# EAGLE design electronic_load (EAGLE 6.5.0)
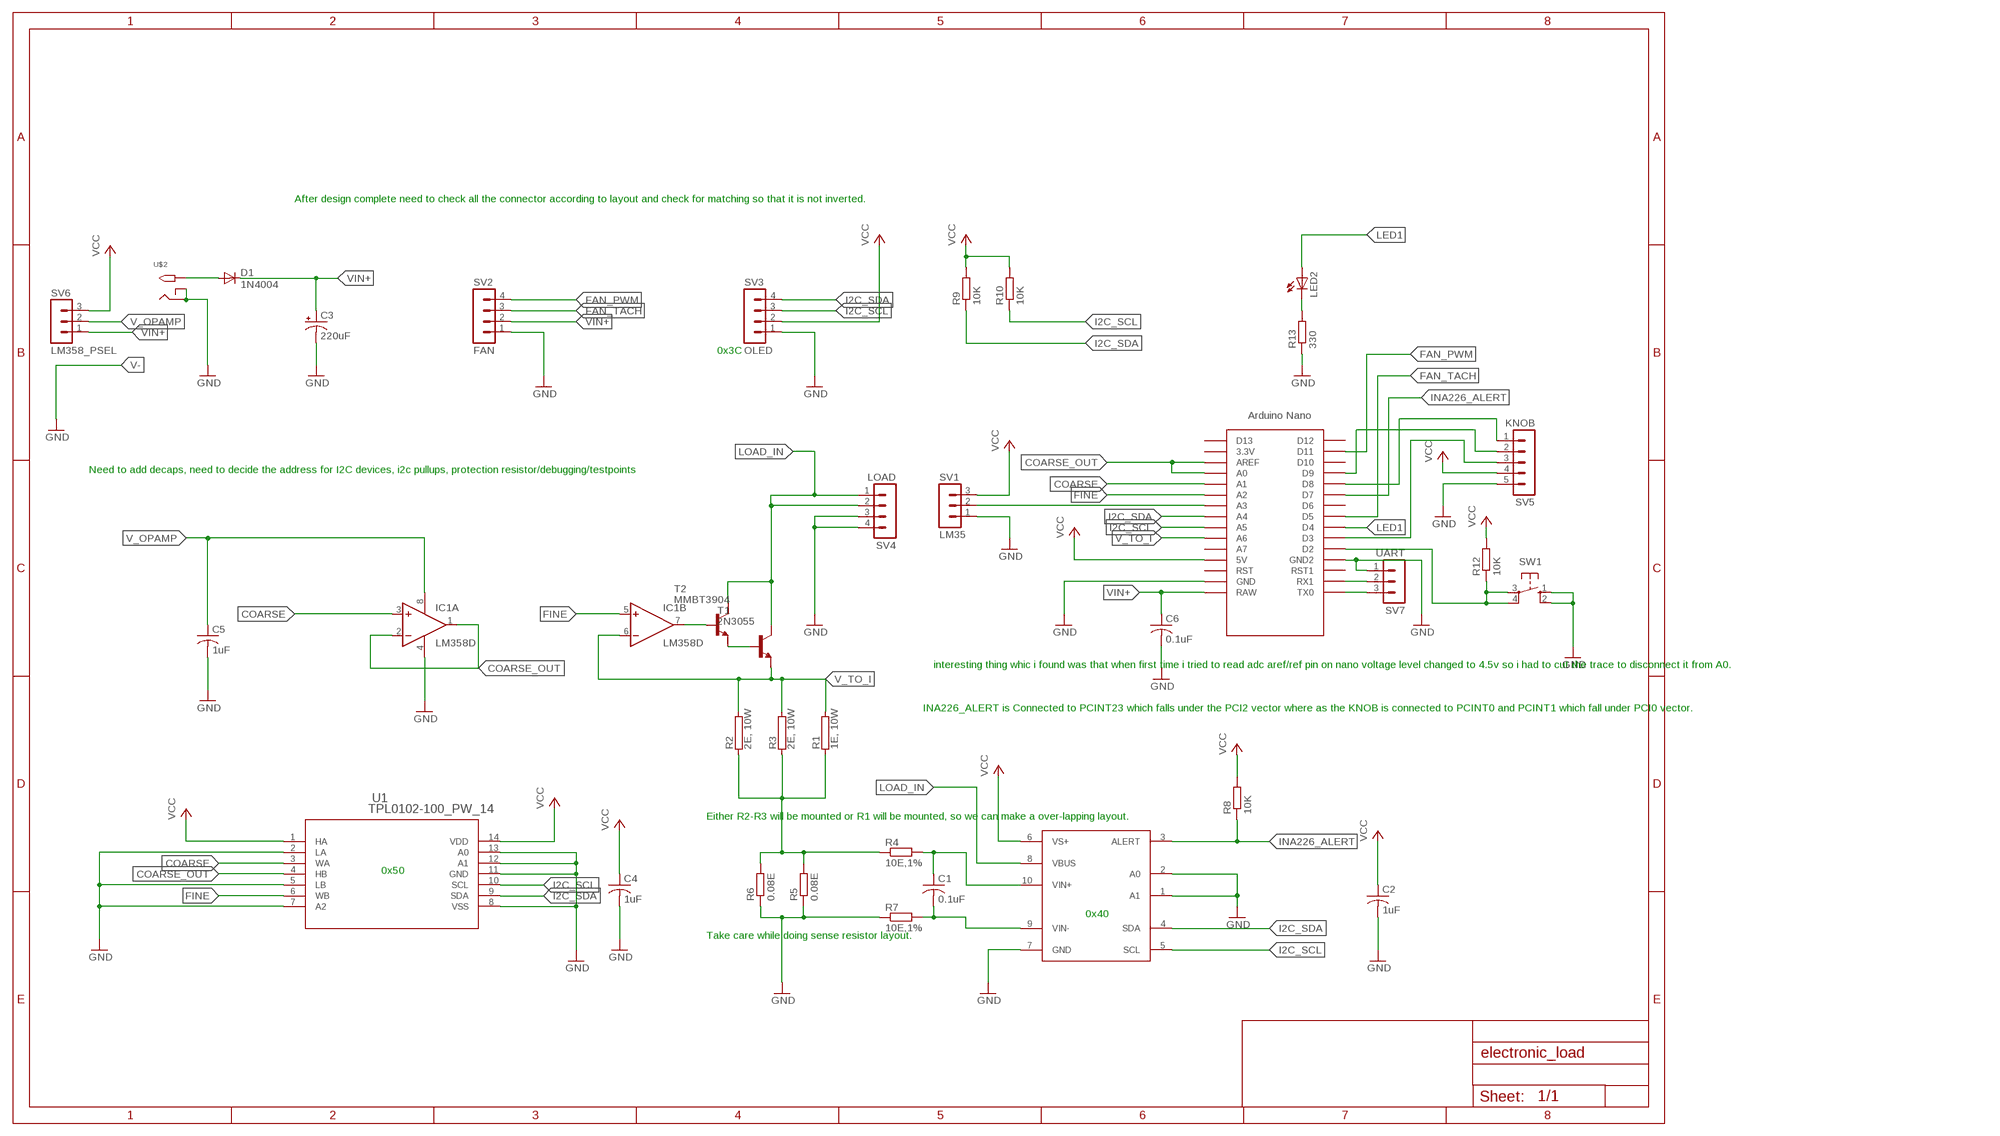
[diagram p0: schematic, sheet 1]

## Parts
C1  0.1uF  C-USC0805  [C0805]
C2  1uF  C-USC0805  [C0805]
C3  220uF  CPOL-USE3.5-8  [E3,5-8]
C4  1uF  C-USC0805  [C0805]
C5  1uF  C-USC1206  [C1206]
C6  0.1uF  C-USC1206  [C1206]
D1  1N4004  [DO41-10]
IC1  LM358D  [SO08]
LED2  LED3MM  [LED3MM]
R1  1E, 10W  RAC10  [AC10]
R2  2E, 10W  RCA4150  [CA4150]
R3  2E, 10W  RCA4150  [CA4150]
R4  10E,1%  R-EU_R0805  [R0805]
R5  0.08E  R-EU_R2512  [R2512]
R6  0.08E  R-EU_R2512  [R2512]
R7  10E,1%  R-EU_R0805  [R0805]
R8  10K  R-EU_R0805  [R0805]
R9  10K  R-EU_R0805  [R0805]
R10  10K  R-EU_R0805  [R0805]
R12  10K  R-EU_R0805  [R0805]
R13  330  R-EU_R0805  [R0805]
SV1  LM35  MA03-1  [MA03-1]
SV2  FAN  MA04-1  [MA04-1]
SV3  OLED  MA04-1  [MA04-1]
SV4  LOAD  MA04-1  [MA04-1]
SV5  KNOB  MA05-1  [MA05-1]
SV6  LM358_PSEL  MA03-1  [MA03-1]
SV7  UART  MA03-1  [MA03-1]
SW1  10-XX  [B3F-10XX]
T1  2N3055  [TO3]
T2  MMBT3904  MMBT3904LT1-NPN-SOT23-BEC  [SOT23-BEC]
U1  TPL0102-100_PW_14  [PW14]
U2  INA226AIDGST  [SOP50P490X110-10N]
U$1  NANO  [NANO]
U$2  2.1MMJACKTHM  [PJ-102A]

## Nets
COARSE: IC1.3(A:+IN) U1.3(WA) U$1.A1
COARSE_OUT: IC1.1(A:OUT) IC1.2(A:-IN) U1.4(HB) U$1.A0 U$1.AREF
FAN_PWM: SV2.4 U$1.D11
FAN_TACH: SV2.3 U$1.D5
FINE: IC1.5(B:+IN) U1.6(WB) U$1.A2
GND: C2.2 C3.- C4.2 C5.2 C6.2 IC1.4(P:V-) R5.1 R6.1 R7.1 R13.1 SV1.1 SV2.1 SV3.1 SV4.3 SV4.4 SV5.5 SV7.1 SW1.1(S) SW1.2(S1) U1.2(LA) U1.5(LB) U1.7(A2) U1.8(VSS) U1.11(GND) U1.12(A1) U1.13(A0) U2.1(A1) U2.2(A0) U2.7(GND) U$1.GND U$1.GND1(GND2) U$2.RING U$2.RING_SW
I2C_SCL: R10.1 SV3.3 U1.10(SCL) U2.5(SCL) U$1.A5
I2C_SDA: R9.1 SV3.4 U1.9(SDA) U2.4(SDA) U$1.A4
INA226_ALERT: R8.1 U2.3(ALERT) U$1.D7
LED1: LED2.A U$1.D4
LOAD_IN: SV4.1 SV4.2 T1.C T1.C/(C) T2.C U2.8(VBUS)
N$1: SV7.2 U$1.RX1
N$2: D1.A U$2.TIP
N$3: T1.B T2.E
N$4: R1.1 R2.1 R3.1 R4.1 R5.2 R6.2
N$5: C1.1 R4.2 U2.10(VIN+)
N$6: SV1.2 U$1.A3
N$7: C1.2 R7.2 U2.9(VIN-)
N$8: IC1.7(B:OUT) T2.B
N$9: SV5.3 U$1.D3
N$11: R12.1 SW1.3(P) SW1.4(P1) U$1.D2
N$13: LED2.K(C) R13.2
N$14: SV7.3 U$1.TX0
N$15: SV5.2 U$1.D9
N$16: SV5.1 U$1.D8
V_OPAMP: C5.1 IC1.8(P:V+) SV6.2
V_TO_I: IC1.6(B:-IN) R1.2 R2.2 R3.2 T1.E U$1.A6
VCC: C2.1 C4.1 R8.2 R9.2 R10.2 R12.2 SV1.3 SV3.2 SV5.4 SV6.3 U1.1(HA) U1.14(VDD) U2.6(VS+) U$1.5V
VIN+: C3.+ C6.1 D1.C SV2.2 SV6.1 U$1.RAW
Unconnected: U$1.3.3V U$1.A7 U$1.D6 U$1.D10 U$1.D12 U$1.D13 U$1.RST U$1.RST1

## Notes on the sheet
- After design complete need to check all the connector according to layout and check for matching so that it is not inverted.
- 0x3C
- Need to add decaps, need to decide the address for I2C devices, i2c pullups, protection resistor/debugging/testpoints
- interesting thing whic i found was that when first time i tried to read adc aref/ref pin on nano voltage level changed to 4.5v so i had to cut the trace to disconnect it from A0.
- INA226_ALERT is Connected to PCINT23 which falls under the PCI2 vector where as the KNOB is connected to PCINT0 and PCINT1 which fall under PCI0 vector.
- Either R2-R3 will be mounted or R1 will be mounted, so we can make a over-lapping layout.
- 0x50
- 0x40
- Take care while doing sense resistor layout.

## Library data of the parts
C1 C2 C4-C6 = adafruit:C-US: CAPACITOR, American symbol
C3 = adafruit:CPOL-US: POLARIZED CAPACITOR, American symbol
D1 = adafruit:1N4004: DIODE General purpose 1N400x type rectifier (With bigger pads) http://www.ladyada.net/library/pcb/eaglelibrary.html
IC1 = linear:LM358: OP AMP also LM158; LM258; LM2904 Source: http://cache.national.com/ds/LM/LM158.pdf
LED2 = adafruit:LED: LED OSRAM: - CHIPLED LG R971, LG N971, LY N971, LG Q971, LY Q971, LO R971, LY R971 LH N974, LH R974 LS Q976, LO Q976, LY Q976 LO Q996 - Hyper CHIPLED LW Q18S LB Q993, LB Q99A, LB R99A - SideLED LS A670, LO A670, LY A670, LG A670, LP A670 LB A673, LV A673, LT A673, LW A673 LH A674 LY A675 LS A676, LA A676, LO A676, LY A676, LW A676 LS A679, LY A679, LG A679 - Hyper Micro SIDELED® LS Y876, LA Y876, LO Y876, LY Y876 LT Y87S - SmartLED LW L88C, LW L88S LB L89C, LB L89S, LG L890 LS L89K, LO L89K, LY L89K LS L896, LA L896, LO L896, LY L896 - TOPLED LS T670, LO T670, LY T670, LG T670, LP T670 LSG T670, LSP T670, LSY T670, LOP T670, LYG T670 LG T671, LOG T671, LSG T671 LB T673, LV T673, LT T673, LW T673 LH T674 LS T676, LA T676, LO T676, LY T676, LB T676, LH T676, LSB T676, LW T676 LB T67C, LV T67C, LT T67C, LS T67K, LO T67K, LY T67K, LW E67C LS E67B, LA E67B, LO E67B, LY E67B, LB E67C, LV E67C, LT E67C LW T67C LS T679, LY T679, LG T679 LS T770, LO T770, LY T770, LG T770, LP T770 LB T773, LV T773, LT T773, LW T773 LH T774 LS E675, LA E675, LY E675, LS T675 LS T776, LA T776, LO T776, LY T776, LB T776 LHGB T686 LT T68C, LB T68C - Hyper Mini TOPLED® LB M676 - Mini TOPLED Santana® LG M470 LS M47K, LO M47K, LY M47K Source: http://www.osram.convergy.de/
R1-R3 = resistor-power:R: Power Resitor; OC_FARNELL: unknown; OC_NEWARK: unknown
R4 R7 = resistor:R-EU_: RESISTOR, European symbol
R5 R6 R8-R10 R12 R13 = rcl:R-EU_: RESISTOR, European symbol
SV1 SV6 SV7 = con-lstb:MA03-1: PIN HEADER; OC_FARNELL: unknown; OC_NEWARK: unknown
SV2-SV4 = con-lstb:MA04-1: PIN HEADER; OC_FARNELL: unknown; OC_NEWARK: unknown
SV5 = con-lstb:MA05-1: PIN HEADER; OC_FARNELL: unknown; OC_NEWARK: unknown
SW1 = switch-omron:10-XX: OMRON SWITCH; MPN: B3F-1000; OC_FARNELL: 176432; OC_NEWARK: 36M3542
T1 = transistor:2N3055: NPN TRANSISTOR
T2 = transistor:*-NPN-: NPN Transistror BF959 corrected 2008.03.06
U1 = tpl0102:TPL0102-100_PW_14; DATASHEETURL: http://www.ti.com/lit/gpn/TPL0102-100; DESCRIPTION: 256 Taps Dual Channel Digital Potentiometer with I2C Interface and Non-Volatile Memory; FAMILY_NAME: DIGITAL POTENTIOMETER; GENERIC_PART_NUMBER: TPL0102-100; INDUSTRY_STD_PKG_TYPE: TSSOP; MANUFACTURER: Texas Instruments; MANUFACTURER_PART_NUMBER: tpl0102-100_pw_14; PACKAGE_DESIGNATOR: PW; PIN_COUNT: 14; VENDOR: Texas Instruments
U2 = ina226:INA226AIDGST: Bi-Directional CURRENT/POWER MONITOR with I2C Interface,MSOP-10; MPN: INA226AIDGST; OC_FARNELL: 1924807; OC_NEWARK: 51T4807; PACKAGE: MSOP-10; SUPPLIER: TEXAS INSTRUMENTS
U$1 = Arduino-clone:NANO
U$2 = adafruit:2.1MMJACK: 2.1mm x 5.5mm THM DC jack with internal switch. Digikey part #PJ-102A, 4UCON part #05537 2.1mm x 5.5mm SMT DC jack with internal switch. Digikey part #PJ-002A-SMT, 4UCON part #03267 By microbuilder.eu & adafruit.com

## Board
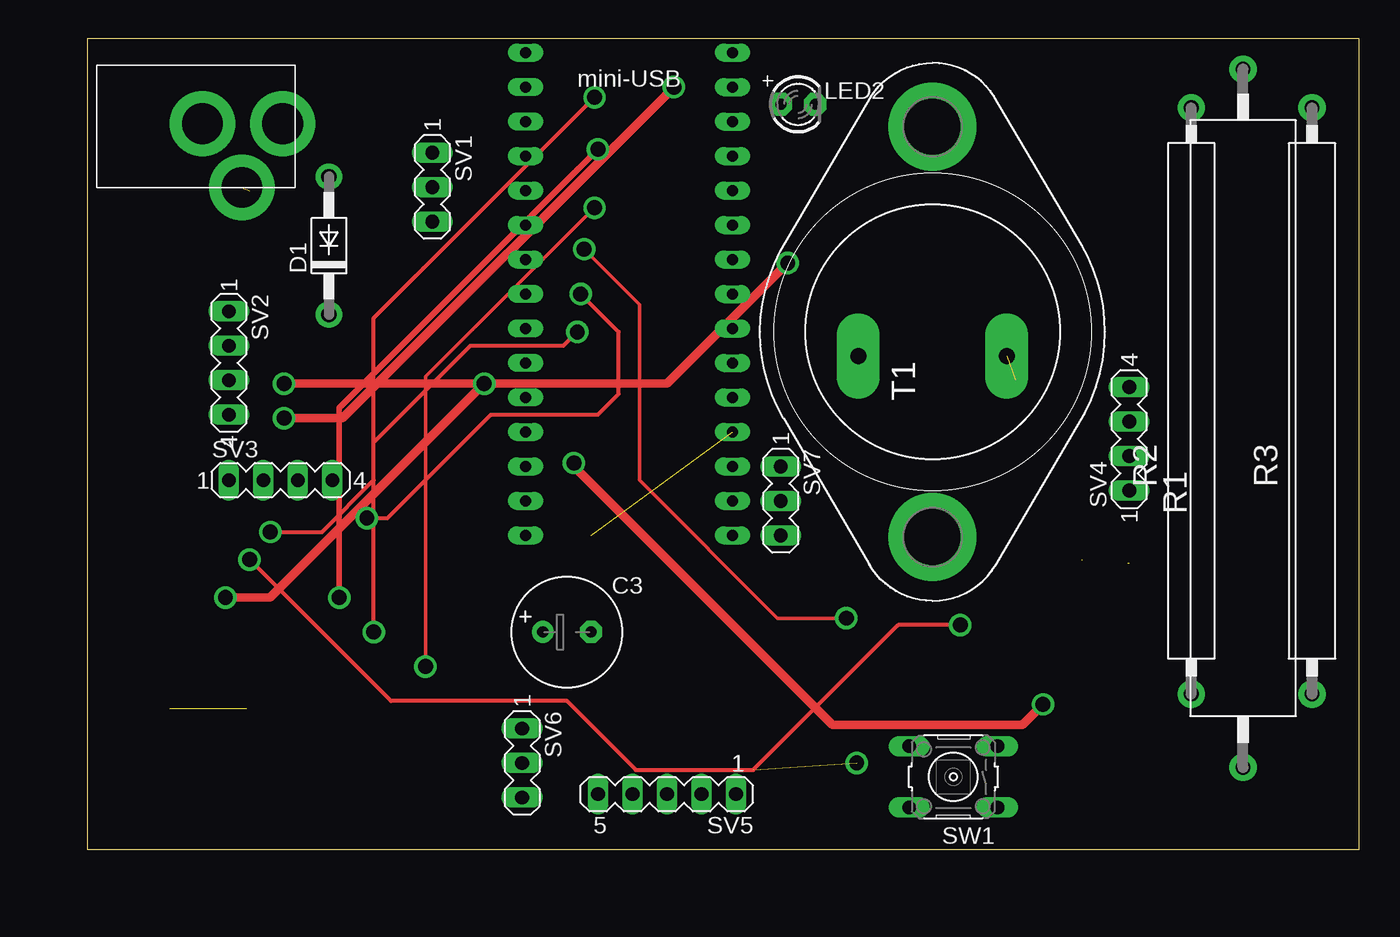
[diagram p1: board, top side]
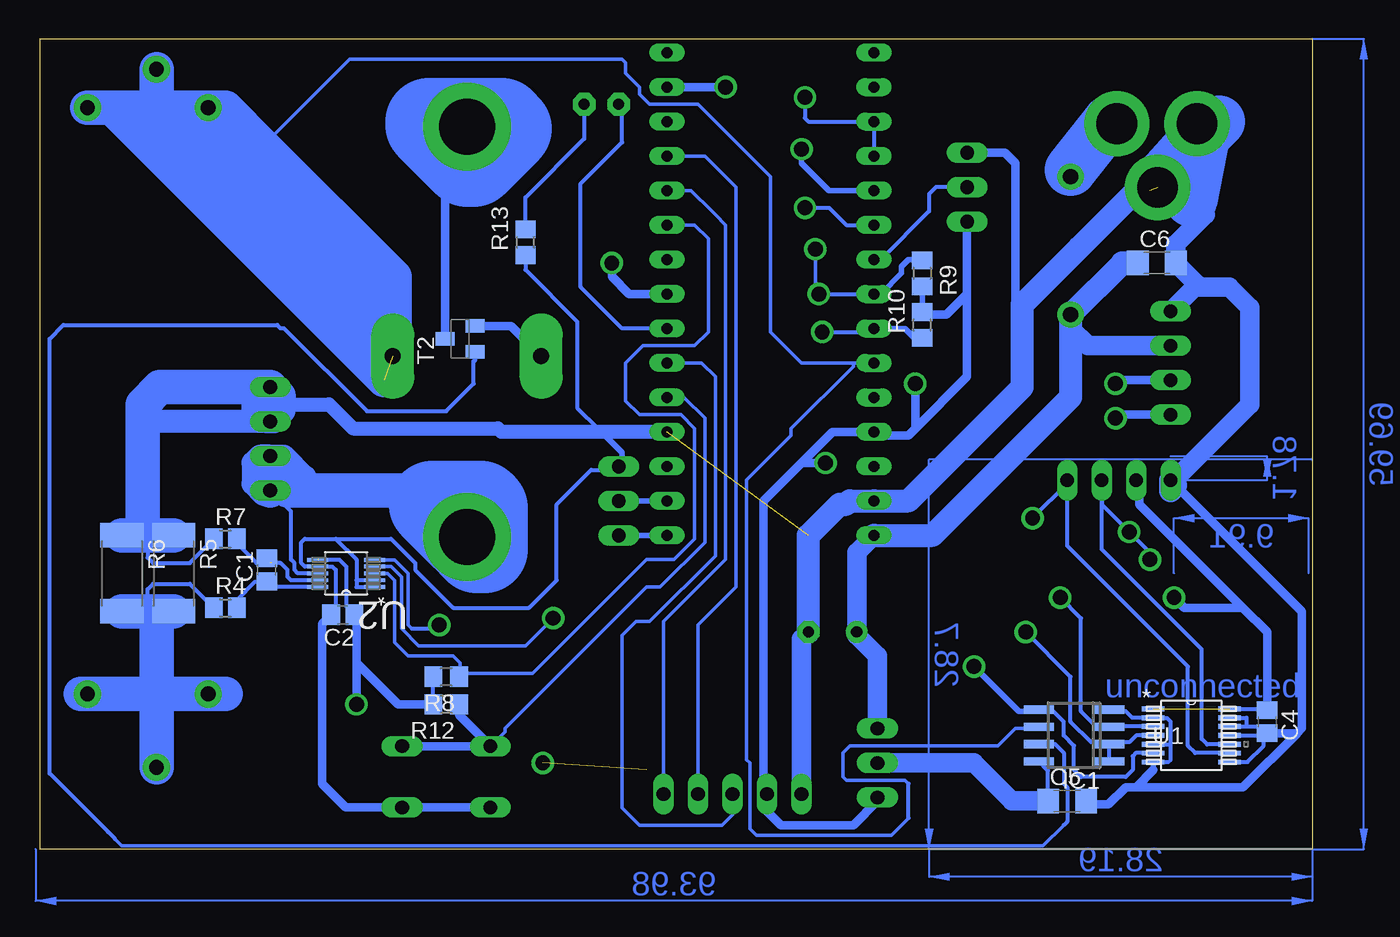
[diagram p2: board, bottom side, seen from below]

Size 93.65 x 59.68 mm. Coordinates in mm from the lower left corner, seen from the top.
Outline: 0,0 93.65,0 93.65,59.68 0,59.68 0,0
Copper layers (1*16): Top 0.035mm / dielectric 1.5mm / Bottom 0.035mm
Design rules "default": minimum track width 10mil, minimum drill 24mil, track to track 8mil, track to pad 8mil, pad to pad 8mil, via to via 8mil, smd to smd 8mil, copper to edge 40mil, drill to drill 8mil, minimum pad ring 10mil, minimum via ring 8mil, stop-mask expansion 4mil, vias tented up to drill 0mil, thermal gap 10mil

### Footprints (pad centres in the part's own frame; a part is rotated, then mirrored left to right if it is on the bottom)
C0805 = smd 1.3 x 1.5: 1 -0.85,0; 2 0.85,0
E3,5-8 = drill 0.813 pad 1.6: + -1.778,0 | drill 0.813 pad 1.6 octagon: - 1.778,0
C1206 = smd 1.6 x 1.8: 1 -1.4,0; 2 1.4,0
DO41-10 = drill 1.118 pad 1.93: A 5.08,0; C -5.08,0
SO08 = smd 0.6 x 2.2: 1 -1.905,-2.6; 2 -0.635,-2.6; 3 0.635,-2.6; 4 1.905,-2.6; 5 1.905,2.6; 6 0.635,2.6; 7 -0.635,2.6; 8 -1.905,2.6
LED3MM = drill 0.813 pad 1.676 octagon: A -1.27,0; K 1.27,0
AC10 = drill 1.1 pad 2: 1 -25.725,0; 2 25.7,0
CA4150 = drill 1.1 pad 2: 1 -21.59,0; 2 21.59,0
R0805 = smd 1.3 x 1.5: 1 -0.85,0; 2 0.85,0
R2512 = smd 1.8 x 3.2: 1 -2.8,0; 2 2.8,0
R0805' = smd 1.3 x 1.5: 1 -0.95,0; 2 0.95,0
MA03-1 = drill 1.016 long: 1 -2.54,0; 2 0,0; 3 2.54,0
MA04-1 = drill 1.016 long: 1 -3.81,0; 2 -1.27,0; 3 1.27,0; 4 3.81,0
MA05-1 = drill 1.016 long: 1 -5.08,0; 2 -2.54,0; 3 0,0; 4 2.54,0; 5 5.08,0
B3F-10XX = drill 1.016 long: 1 -3.251,2.261; 2 3.251,2.261; 3 -3.251,-2.261; 4 3.251,-2.261
TO3 = drill 1.194 pad 3.15 long: B -1.778,5.461; E -1.778,-5.461 | drill 4.115 pad 6.477: C 15.113,0; C/ -15.113,0
SOT23-BEC = smd 1 x 1.4: B -0.95,-1.1; C 0,1.1; E 0.95,-1.1
PW14 = smd 1.676 x 0.356: 1 -2.819,1.956; 2 -2.819,1.295; 3 -2.819,0.66; 4 -2.819,0; 5 -2.819,-0.66; 6 -2.819,-1.295; 7 -2.819,-1.956; 8 2.819,-1.956; 9 2.819,-1.295; 10 2.819,-0.66; 11 2.819,0; 12 2.819,0.66; 13 2.819,1.295; 14 2.819,1.956
SOP50P490X110-10N = smd 1.549 x 0.279: 1 -2.108,0.991; 2 -2.108,0.508; 3 -2.108,0; 4 -2.108,-0.508; 5 -2.108,-0.991; 6 2.108,-0.991; 7 2.108,-0.508; 8 2.108,0; 9 2.108,0.508; 10 2.108,0.991
NANO = drill 0.8 long: 3.3V -10.16,24.13; 5V -10.16,-1.27; A0 -10.16,19.05; A1 -10.16,16.51; A2 -10.16,13.97; A3 -10.16,11.43; A4 -10.16,8.89; A5 -10.16,6.35; A6 -10.16,3.81; A7 -10.16,1.27; AREF -10.16,21.59; D2 5.08,1.27; D3 5.08,3.81; D4 5.08,6.35; D5 5.08,8.89; D6 5.08,11.43; D7 5.08,13.97; D8 5.08,16.51; D9 5.08,19.05; D10 5.08,21.59; D11 5.08,24.13; D12 5.08,26.67; D13 -10.16,26.67; GND -10.16,-6.35; GND1 5.08,-1.27; RAW -10.16,-8.89; RST -10.16,-3.81; RST1 5.08,-3.81; RX1 5.08,-6.35; TX0 5.08,-8.89
PJ-102A = drill 3 pad 4.8: RING 0.1,-3.39; RING_SW -4.6,-6.29; TIP 0.1,-9.29

### Placement (x,y rotation side)
C1  76.96,20.57 90 bottom
C2  71.37,17.27 180 bottom
C3  35.31,16 0 top
C4  3.3,9.4 270 bottom
C5  18.03,3.56 0 bottom
C6  11.43,43.18 0 bottom
D1  17.78,44.45 90 top
IC1  17.53,8.38 90 bottom
LED2  52.32,54.86 0 top
R1  85.09,31.75 90 top
R2  81.28,33.02 90 top
R3  90.17,33.02 90 top
R4  80.01,17.78 0 bottom
R5  83.82,20.32 270 bottom
R6  87.63,20.32 270 bottom
R7  80.01,22.86 0 bottom
R8  10K  [R0805']  63.75,12.7 180 bottom
R9  10K  [R0805']  28.7,42.42 270 bottom
R10  10K  [R0805']  28.7,38.61 90 bottom
R12  10K  [R0805']  63.75,10.67 180 bottom
R13  330  [R0805']  57.91,44.7 90 bottom
SV1  25.4,48.77 270 top
SV2  10.41,35.81 270 top
SV3  14.22,27.18 0 top
SV4  76.71,30.23 90 top
SV5  42.67,4.06 180 top
SV6  32,6.35 270 top
SV7  51.05,25.65 270 top
SW1  63.75,5.33 180 top
T1  62.23,38.1 90 top
T2  62.74,37.59 90 bottom
U1  8.89,8.38 0 bottom
U2  71.12,20.32 180 bottom
U$1  42.42,32 0 top
U$2  5.08,53.34 90 top

### Tracks (layer width: path | path; a pad name or v marks a point on that pad's centre or on a via)
COARSE  (via drill 1.1)
  Top 0.406: v18.54,18.54 18.54,32.51 v37.59,51.56
  Bottom 0.305: U1.3 14.9,9.04 IC1.3 15.88,9.02 17.02,10.16 17.02,17.02 v18.54,18.54
  Bottom 0.406: v37.59,51.56 37.59,50.55 35.56,48.51 U$1.A1
COARSE_OUT  (via drill 1.1)
  Top 0.305: v21.08,16 21.08,39.12 v37.34,55.37
  Bottom 0.305: U1.4 12.95,8.38 13.46,7.87 14.8,7.87 | 14.8,7.87 IC1.2 IC1.1 | 14.8,7.87 16.26,7.87 17.78,9.4 17.78,12.7 v21.08,16 | v37.34,55.37 37.34,53.85 37.08,53.59 U$1.AREF U$1.A0
FAN_PWM  (via drill 1.1)
  Top 0.61: v14.48,31.75 18.8,31.75 v43.18,56.13
  Bottom 0.61: SV2.4 14.22,32 v14.48,31.75 | v43.18,56.13 U$1.D11
FAN_TACH  (via drill 1.1)
  Top 0.61: v14.48,34.29 42.67,34.29 v51.56,43.18
  Bottom 0.61: SV2.3 14.22,34.54 v14.48,34.29 | v51.56,43.18 51.56,42.16 50.29,40.89 U$1.D5
FINE  (via drill 1.1)
  Top 0.254: v24.89,13.46 24.89,34.8 v37.34,47.24
  Bottom 0.305: U1.6 12.98,7.09 13.21,6.86 13.21,5.84 13.72,5.33 17.02,5.33 17.53,5.84 17.53,7.62 18.29,8.38 18.29,9.4 19.3,10.41 20,10.41 | 20,10.16 IC1.5 20,10.41 | v37.34,47.24 35.56,47.24 34.29,45.97 U$1.A2 | 20,10.41 20.57,10.41 20.83,10.16
  Bottom 0.406: 20.83,10.16 21.59,10.16 v24.89,13.46
GND  (2 unrouted)
  Bottom 0.305: 85.75,23.12 85.75,21.49 85.34,21.08 82.64,21.08 R7.1 | C2.2 71.88,17.61 71.88,20.57 72.14,20.83 U2.7 74.17,20.83 74.42,21.08 74.42,22.61 74.17,22.86 71.88,22.86 | 71.88,22.86 70.36,21.34 70.36,19.81 | 70.36,19.81 70.36,19.3 69.04,19.3 U2.1 | U2.2 70.36,19.81 | 71.88,22.86 67.82,22.86 66.04,21.08 66.04,20.57 63.25,17.78 57.66,17.78 55.63,19.81 55.63,25.4 53.09,27.94 51.31,27.94 SV7.1 | IC1.4 14.8,10.16 13.72,10.16 13.23,9.68 U1.2 11.68,9.65 10.67,9.65 10.41,9.4 10.41,7.62 | U1.7 10.59,6.43 10.41,6.6 10.41,7.62 | U1.5 10.52,7.72 10.41,7.62 | U1.8 4.75,6.43 3.56,7.62 3.56,8.29 C4.2 3.3,9.04 4.83,9.04 | U1.11 3.47,8.38 | U1.12 4.83,9.04 | U1.13 4.83,9.68 4.83,9.04 | 52.83,30.73 52.58,30.99 54.1,32.51 54.1,38.86 57.91,42.67 R13.1
  Bottom 0.406: 3.47,8.38 C4.2 | U1.13 5.46,9.68 | 11.68,5.84 11.68,6.4 U1.7 | SV7.1 50.8,28.19 50.8,29.21 52.32,30.73
  Bottom 0.61: C4.2 1.1,8.55 | 1.1,8.55 0.76,8.89 0.76,17.53 10.03,26.8 | 12.95,4.57 11.68,5.84 | 12.95,4.57 5.08,4.57 1.1,8.55 | 12.95,4.57 13.72,4.57 14.99,3.3 16.38,3.3 C5.2 | 17.27,44.45 17.14,44.32 | SV1.1 22.61,51.31 21.84,50.55 21.84,39.88 21.34,39.88 | C2.2 72.9,16.6 72.9,4.83 71.14,3.07 67.82,3.07 SW1.1 SW1.2
  Bottom 1.016: 77.22,32.77 72.39,32.77 70.61,30.99 59.94,30.99 59.69,30.73 52.83,30.73 52.32,30.73 U$1.GND1
  Bottom 1.422: U$2.RING_SW 9.37,46.74 7.87,46.74 10.03,44.58 C6.2 8.44,41.59 | SV5.5 37.59,15.49 C3.- | 10.03,26.8 10.03,27.31 4.57,32.77 4.57,39.88 6.1,41.4 8.25,41.4 8.44,41.59 | SV2.1 8.44,41.59
  Bottom 1.676: SV4.3 86.11,31.5 | 76.96,34.04 76.2,34.04 75.69,33.53 75.69,32.26 76.45,31.5 76.96,31.5 77.98,32.51 77.98,33.27 77.72,33.27 77.22,32.77 76.96,32.51 | 10.03,26.8 10.41,26.42 SV3.1 | C3.- 37.08,23.11 34.8,25.4 34.29,25.4 34.04,25.65 U$1.GND 29.72,25.65 21.34,34.04 21.34,39.88 21.34,40.13 17.14,44.32 12.95,48.51 11.94,48.51
  Bottom 2.54: R6.1 86.11,23.12 | 86.11,23.12 85.75,23.12 R5.1 | SV4.4 76.96,34.04 84.84,34.04 86.11,32.77 86.11,31.5 86.11,23.12
  Bottom 3.81: U$2.RING 7.82,53.5 6.86,53.59 11.94,48.51 7.87,53.09 8.89,47.75
I2C_SCL  (via drill 1.1)  (1 unrouted)
  Top 0.305: v13.46,23.37 17.27,23.37 21.08,27.18 21.08,29.97 28.19,37.08 35.05,37.08 v36.07,38.1 | v64.26,16.51 59.69,16.51 49.02,5.84 40.39,5.84 35.31,10.92 22.35,10.92 v11.94,21.34
  Bottom 0.254: U2.5 67.54,21.31 66.55,20.32 66.55,16.51 66.29,16.26
  Bottom 0.305: U1.10 7.72,7.72 8.13,8.13 8.13,14.73 15.49,22.1 SV3.3 15.49,25.4 v13.46,23.37 11.94,21.84 v11.94,21.34 | v36.07,38.1 32.51,38.1 U$1.A5 | 66.29,16.26 64.52,16.26 v64.26,16.51
  Bottom 0.406: U$1.A5 29.97,38.35 29.21,37.59 28.77,37.59 R10.1
  other vias: 56.64,6.35
I2C_SDA  (via drill 1.1)
  Top 0.254: v55.88,17.02 50.8,17.02 40.64,27.18 40.64,40.13 v36.58,44.2
  Top 0.305: v20.57,24.38 22.1,24.38 29.72,32 37.59,32 39.12,33.53 39.12,38.1 v36.32,40.89
  Bottom 0.254: U2.4 67.82,20.83 67.06,20.07 67.06,16.26 65.79,14.99 57.91,14.99 v55.88,17.02 | v36.58,44.2 36.58,41.66 35.81,40.89
  Bottom 0.305: U1.9 8.61,7.09 9.14,7.62 9.14,13.46 18.03,22.35 SV3.4 18.03,26.92 v20.57,24.38 | v36.32,40.89 35.81,40.89 U$1.A4
  Bottom 0.406: U$1.A4 31.75,40.89 30.23,42.42 30.23,42.93 29.72,43.43 28.77,43.43 R9.1
INA226_ALERT
  Bottom 0.254: U2.3 68.07,20.32 67.56,19.81 67.56,15.24 66.55,14.22 63.25,14.22 62.74,13.72 62.74,12.77 R8.1 62.55,12.95 57.4,12.95 49.02,21.34 46.99,21.34 45.47,22.86 45.47,30.99 46.48,32 49.53,32 50.55,33.02 50.55,35.81 49.28,37.08 45.47,37.08 44.45,38.1 44.45,44.96 45.47,45.97 U$1.D7
LED1
  Bottom 0.305: U$1.D4 50.8,38.35 53.85,41.4 53.85,49.02 50.8,52.07 50.8,54.61 LED2.A
LOAD_IN
  Bottom 0.305: U2.8 74.68,20.32 74.93,20.57 74.93,21.08 75.18,21.34 75.18,24.89 76.45,26.16 | 76.45,26.16 SV4.1 | 77.22,26.16 76.45,26.16
  Bottom 0.61: T2.C 63.84,51.14 64.52,51.82 63.5,52.83 63.12,53.21 T1.C
  Bottom 1.676: 74.17,27.43 75.69,28.96 SV4.2 77.47,28.96 77.98,28.45 77.98,26.92 77.22,26.16
  Bottom 2.54: SV4.1 76.71,27.69 75.44,26.42 65.79,26.42 64.77,25.4
  Bottom 6.452: T1.C/ 62.36,22.99 | 62.36,22.99 64.77,25.4 61.21,25.4 60.96,25.15 60.96,22.1 61.47,22.1 62.36,22.99 | 63.5,52.83 64.26,52.83 65.02,53.59 59.69,53.59 59.18,53.09 61.72,50.55 62.23,50.55 65.02,53.34
N$1
  Bottom 0.406: SV7.2 U$1.RX1
N$2
  Bottom 1.676: U$2.TIP 14.37,52.94 D1.A
  Bottom 3.81: U$2.TIP 14.83,53.44 14.99,53.59 17.78,50.04
N$3
  Bottom 0.61: T2.E 58.99,38.54 T1.B
N$4
  Bottom 0.305: 85.75,17.52 85.75,19.15 85.34,19.56 82.64,19.56 R4.1
  Bottom 2.54: R6.2 85.75,17.52 85.09,17.52 | 85.09,17.52 R5.2 | 85.09,11.43 R3.1 90.68,11.43 | 85.09,11.43 R2.1 80.01,11.43 | R1.1 85.09,11.43 | 85.09,11.43 85.09,17.52
N$5
  Bottom 0.305: R4.2 79.16,18.38 77.81,19.72 C1.1 76.96,19.33 U2.10
N$6
  Bottom 0.305: SV1.2 27.69,48.77 28.19,48.26 28.19,46.99 31.75,43.43 U$1.A3
N$7  (1 unrouted)
  Bottom 0.305: R7.2 79.16,22.52 77.72,21.08 76.71,21.08 | U2.9 75.18,19.81 75.44,20.07 75.44,20.57 75.95,21.08 76.62,21.08 C1.2
N$8
  Bottom 0.254: 18.29,1.78 19.81,0.25 87.63,0.25 88.65,1.27
  Bottom 0.305: T2.B 61.64,36.07 | 61.64,36.07 61.64,35.98 | IC1.7 18.92,7.75 18.29,7.11 18.29,4.83 18.03,4.57 18.03,2.03 18.29,1.78 | 88.14,0.76 88.65,1.27 92.96,5.59 92.96,37.59 91.95,38.61 76.2,38.61 75.95,38.35 75.69,38.35 69.6,32.26 63.75,32.26 61.72,34.29 61.72,35.98 61.64,36.07
N$9
  Bottom 0.254: SV5.3 42.67,2.54 43.43,1.78 49.53,1.78 50.8,3.05 50.8,15.75 49.78,16.76 48.77,16.76 43.94,21.59 43.94,34.8 44.96,35.81 U$1.D3
N$11
  Bottom 0.254: U$1.D2 46.23,33.27 44.7,31.75 44.7,22.61 48.01,19.3 49.02,19.3 59.44,8.89 59.44,8.66 SW1.4
  Bottom 0.305: SW1.4 60.5,8.08
  Bottom 0.61: R12.1 62.8,9.9 SW1.4 SW1.3
N$13
  Bottom 0.305: LED2.K 53.59,52.32 57.91,48.01 R13.2
N$14
  Bottom 0.406: SV7.3 U$1.TX0
N$15
  Bottom 0.254: SV5.2 45.21,16.51 42.42,19.3 42.42,48.77 44.7,51.05 U$1.D9
  Bottom 0.305: SV5.2 45.47,3.81
N$16
  Bottom 0.254: 47.75,4.57 47.75,16.76 43.18,21.34 43.18,45.97 43.94,46.74 44.2,46.99 45.72,48.51 U$1.D8
  Bottom 0.305: SV5.1 47.75,4.57
V_OPAMP
  Bottom 0.305: C5.1 19.43,5.79 IC1.8
  Bottom 1.422: SV6.2 24.89,6.35 22.1,3.56 C5.1
V_TO_I  (1 unrouted)
  Bottom 0.254: 77.22,51.82 70.87,58.17 50.8,58.17 50.55,57.91 50.55,57.15 49.53,56.13 49.53,55.63 48.77,54.86 45.21,54.86 39.88,49.53 39.88,38.1 37.59,35.81 33.78,35.81 | U$1.A6 33.78,35.81 | 29.72,2.29 30.99,1.02 40.89,1.02 41.4,1.52 41.4,6.35 41.66,6.6 41.66,27.18 38.35,30.48 38.35,30.99 33.78,35.56 33.78,35.81 | 29.72,4.83 29.97,5.08 34.29,5.08 34.54,5.33 34.54,7.11 34.04,7.62 23.11,7.62 21.84,8.89 20.25,8.89 IC1.6
  Bottom 0.305: 29.72,2.29 29.72,4.83
  Bottom 2.54: R3.2 85.09,54.61 | 85.09,54.61 R2.2 80.01,54.61 77.22,51.82 67.56,42.16 67.56,39.37 | R1.2 85.09,54.61 | 85.09,54.61 85.09,53.72 T1.E 67.56,36.45 67.56,39.37 | 88.14,54.36 68.33,34.54 | 67.56,39.37 82.3,54.1
VCC  (via drill 1.1)  (2 unrouted)
  Top 0.61: v35.81,28.45 35.81,28.19 54.86,9.14 68.83,9.14 v70.36,10.67 | v10.16,18.54 13.46,18.54 v29.21,34.29
  Bottom 0.305: 73.2,21.34 71.63,21.34 71.12,20.83 71.12,17.87 C2.1 | U1.14 3.39,10.34 | R12.2 R8.2
  Bottom 0.406: 3.39,10.34 C4.1 | R10.2 R9.2
  Bottom 0.61: C4.1 3.3,16 5.08,17.78 | 5.08,17.78 12.7,25.4 12.7,26.92 SV3.2 | SV6.3 32,3.56 33.78,1.78 39.12,1.78 40.13,2.79 SV5.4 40.39,4.32 40.39,25.65 37.59,28.45 | 37.59,28.45 35.31,30.73 U$1.5V 32,30.48 29.72,30.48 29.46,30.73 29.21,30.99 | R10.2 28.51,39.37 26.92,39.37 25.4,40.89 | SV1.3 25.4,40.89 | 25.4,40.89 25.4,34.8 29.21,30.99 | 37.59,28.45 v35.81,28.45 | v70.36,10.67 70.36,13.72 | 70.36,13.72 70.36,17.11 C2.1 | R12.2 67.31,10.67 70.36,13.72 | 5.08,17.78 9.4,17.78 v10.16,18.54 | v29.21,34.29 29.21,30.99
VIN+
  Bottom 0.305: C6.1 13.46,43.18
  Bottom 1.422: U$1.RAW 33.53,21.84 C3.+ 33.53,15.75 32,14.22 SV6.1 | SV2.2 16.51,37.08 17.78,38.35
  Bottom 1.676: U$1.RAW 27.94,23.11 17.78,33.27 17.78,38.35 D1.C 13.97,43.18 C6.1
(copper drawn outside any net)
  shapes: Bottom area x6

### Text on the board
Bottom: unconnected | The top layer is not for fab it is only to give an idea for jumper wire connections.